# Altium project Flight_Controller.PrjPcb
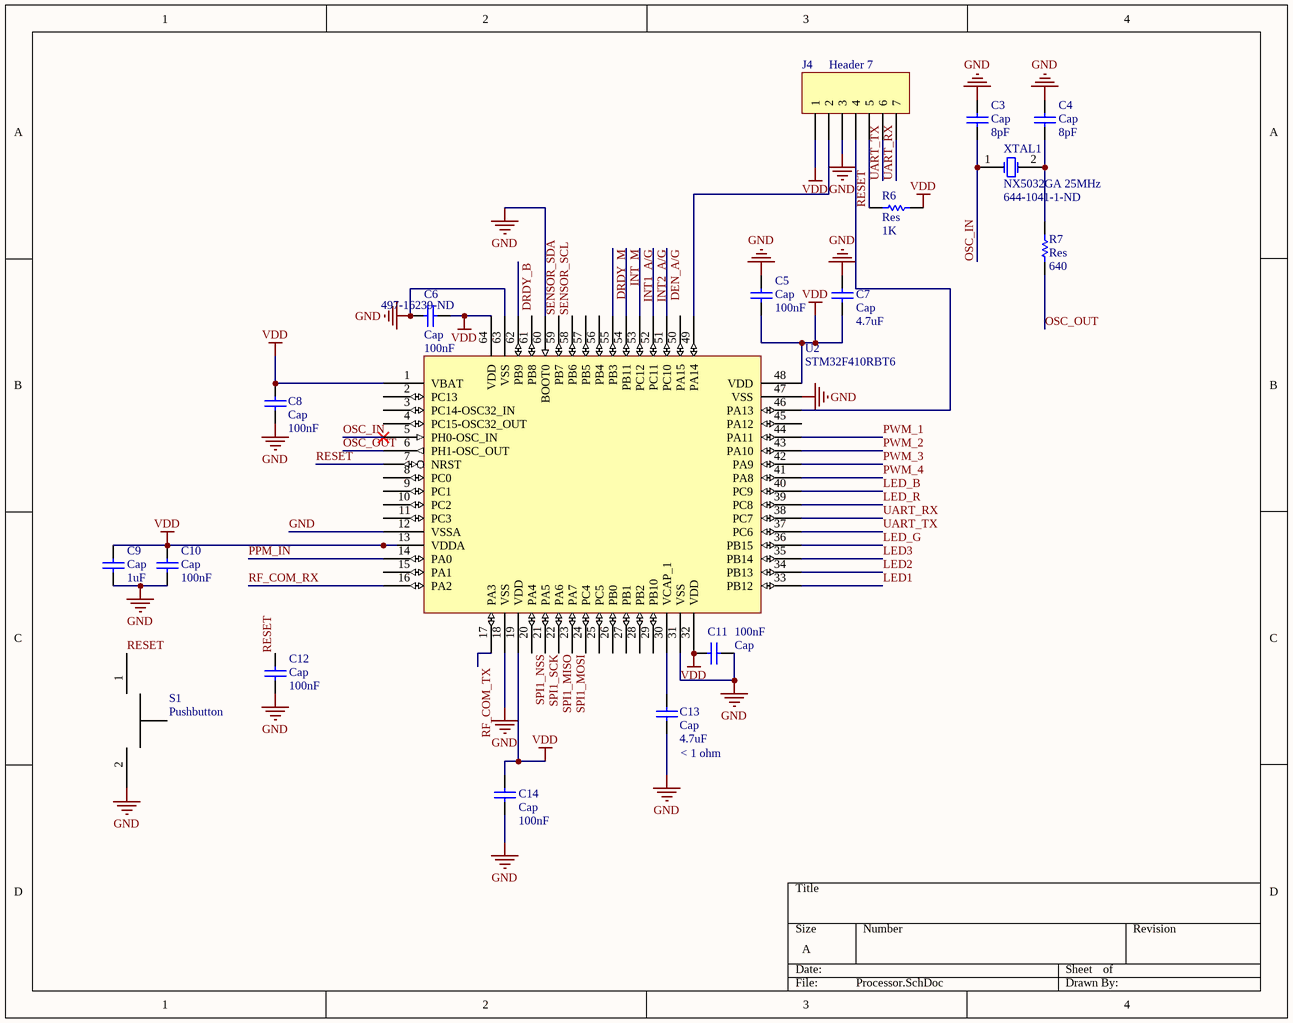
[diagram p0: Processor.SchDoc]
5 sheets, 52 parts. Net scope: global (net labels, ports and power ports of the same name join across sheets).
Board file: Flight_Controller.PcbDoc
Sheets:
  Processor.SchDoc
  Debug.SchDoc
  SENSORS.SchDoc
  Power_Regulation.SchDoc
  RC_Connections.SchDoc

## Sheet Processor.SchDoc
size A

### Parts
C3  Cap  value 8pF  [C0805]
C4  Cap  value 8pF  [C0805]
C5  Cap  value 100nF  [C0805]
C6  Cap  value 100nF  [C0805]
C7  Cap  value 4.7uF  [C0805]
C8  Cap  value 100nF  [C0805]
C9  Cap  value 1uF  [C0805]
C10  Cap  value 100nF  [C0805]
C11  Cap  value 100nF  [C0805]
C12  Cap  value 100nF  [C0805]
C13  Cap  value 4.7uF  ESR: < 1 ohm  [C0805]
C14  Cap  value 100nF  [C0805]
J4  Header 7  [HDR1X7]
R6  Res  value 1K  [3216[1206]]
R7  Res  value 640  [3216[1206]]
S1  Pushbutton  [TactileSwitch]
U2  STM32F410RBT6  Supplier Part Number 1: 497-16239-ND  [LQFP-64 10x10mm]
XTAL1  NX5032GA 25MHz  Supplier Part Number 1: 644-1041-1-ND  [NX5032GA]

### Nets
GND: C3.1 C4.1 C5.2 C6.1 C7.2 C8.2 C9.2 C10.2 C11.2 C12.2 C13.1 C14.1 J4.3 S1.2 U2.12(VSSA) U2.18(VSS) U2.31(VSS) U2.47(VSS) U2.60(BOOT0) U2.63(VSS)
VDD: C5.1 C6.2 C7.1 C8.1 C9.1 C10.1 C11.1 C14.2 J4.1 R6.2 U2.1(VBAT) U2.13(VDDA) U2.19(VDD) U2.32(VDD) U2.48(VDD) U2.64(VDD)
DEN_A/G: U2.51(PC10)
DRDY_B: U2.62(PB9)
DRDY_M: U2.55(PB3)
INT1_A/G: U2.53(PC12)
INT2_A/G: U2.52(PC11)
INT_M: U2.54(PB11)
LED1: U2.33(PB12)
LED2: U2.34(PB13)
LED3: U2.35(PB14)
LED_B: U2.40(PC9)
LED_G: U2.36(PB15)
LED_R: U2.39(PC8)
OSC_IN: C3.2 U2.5(PH0-OSC_IN) XTAL1.1(OSC1)
OSC_OUT: R7.1 U2.6(PH1-OSC_OUT)
PPM_IN: U2.14(PA0)
PWM_1: U2.44(PA11)
PWM_2: U2.43(PA10)
PWM_3: U2.42(PA9)
PWM_4: U2.41(PA8)
RESET: C12.1 J4.5 R6.1 S1.1 U2.7(NRST)
RF_COM_RX: U2.16(PA2)
RF_COM_TX: U2.17(PA3)
SENSOR_SCL: U2.58(PB6)
SENSOR_SDA: U2.59(PB7)
SPI1_MISO: U2.22(PA6)
SPI1_MOSI: U2.23(PA7)
SPI1_NSS: U2.20(PA4)
SPI1_SCK: U2.21(PA5)
UART_RX: J4.7 U2.38(PC7)
UART_TX: J4.6 U2.37(PC6)
NetC4_2: C4.2 R7.2 XTAL1.2(OSC2)
NetC13_2: C13.2 U2.30(VCAP_1)
NetJ4_2: J4.2 U2.49(PA14)
NetJ4_4: J4.4 U2.46(PA13)

Not connected (* = marked no-connect by the designer): U2 2(PC13) 3(PC14-OSC32_IN) 4(PC15-OSC32_OUT) 8(PC0) 9(PC1) 10(PC2) 11(PC3) 15(PA1) 24(PC4) 25(PC5) 26(PB0) 27(PB1) 28(PB2) 29(PB10) 45(PA12) 50(PA15) 56(PB4) 57(PB5) 61(PB8)

### Library data of the parts
C3-C14 = Cap: Capacitor; Published: 8-Jun-2000; LatestRevisionDate: 17-Jul-2002; LatestRevisionNote: Re-released for DXP Platform.; PackageReference: C1206; Publisher: Altium Limited
J4 = Header 7: Header, 7-Pin; LatestRevisionDate: 17-Jul-2002; LatestRevisionNote: Re-released for DXP Platform.; Publisher: Altium Limited
R6 R7 = Res: Surface Mount Resistor; Published: 8-Jun-2000; LatestRevisionDate: 17-Jul-2002; LatestRevisionNote: Re-released for DXP Platform.; PackageReference: AXIAL-0.5; Publisher: Altium Limited
U2 = STM32F410RB_PINOUT: 64-LQFP - Pinout Representation; Manufacturer: STMicroelectronics; Frequency: 100; Interface: I2C,SPI,IrDA,UART,USART,LIN; Number of I/Os: 50; Oscillator Type: Internal; RAM Size: 32; Min Supply Voltage: 1.7; Max Supply Voltage: 3.6; Memory Type: FLASH; Memory Size: 128; Peripherals: Brown-out Detect/Reset,POR,PWM,WDT,DMA; Supplier 1: Digikey; Manufacturer Part Number: STM32F410RBT6; Pricing 2: 1=4.4, 10=3.951, 100=3.237, 500=2.7556, 1000=2.324 (USD); Case/Package: LQFP; Number of Pins: 64; Min Operating Temperature: -40; Max Operating Temperature: 85; Packaging: Tray; REACH SVHC: No SVHC; Lead Free: Lead Free; ComponentLink1URL: http://www.farnell.com/datasheets/2006536.pdf; ComponentLink1Description: http://www.farnell.com/datasheets/2006536.pdf
XTAL1 = NX5032GA: Manufacturer: Nihon Dempa Kogyo (NDK); Manufacturer Part Number: NX5032GA-25.000000MHZ-LN-CD-1; Frequency: 25; Frequency Tolerance: 50; Load Capacitance: 8; ESR (Equivalent Series Resistance): 70; Supplier 1: Digikey; Stock 1: 128038; Pricing 1: 1=0.66, 10=0.55, 50=0.495, 100=0.44, 500=0.418 (USD); Case/Package: SMD/SMT; Number of Pins: 2; Min Operating Temperature: -10; Max Operating Temperature: 70; Packaging: Tape and Reel; Frequency Stability: 50; Package Quantity: 1000; Length: 0.197; Height: 0.059; Width: 0.126; ComponentLink1URL: https://datasheet.ciiva.com/856/nx5032ga-856797.pdf; ComponentLink1Description: https://datasheet.ciiva.com/856/nx5032ga-856797.pdf; ComponentLink2URL: https://datasheet.ciiva.com/856/nx5032ga-856798.pdf; ComponentLink2Description: https://datasheet.ciiva.com/856/nx5032ga-856798.pdf; ComponentLink3URL: https://datasheet.ciiva.com/856/nx5032ga-856799.pdf; ComponentLink3Description: https://datasheet.ciiva.com/856/nx5032ga-856799.pdf

## Sheet Debug.SchDoc
size A
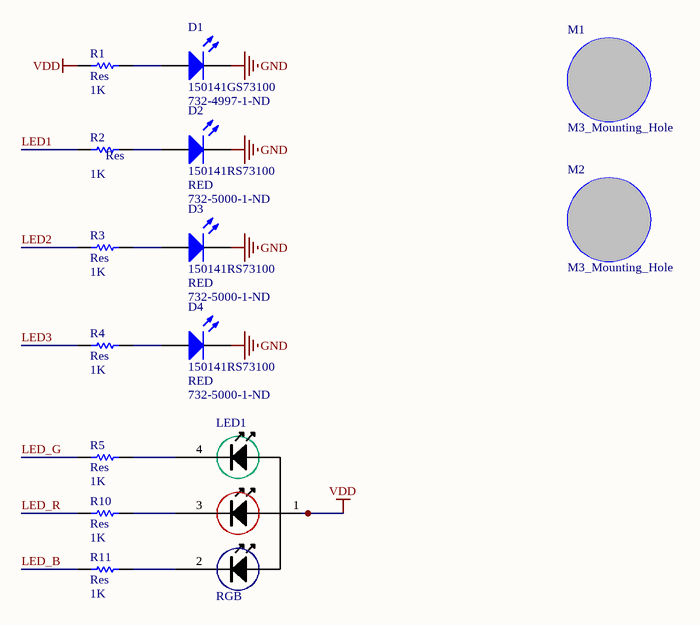
[diagram p1: Debug.SchDoc]

### Parts
D1  150141GS73100  Supplier Part Number 1: 732-4997-1-ND  [150141RS73100]
D2  150141RS73100  Colour: RED  Supplier Part Number 2: 732-5000-1-ND  [150141RS73100]
D3  150141RS73100  Colour: RED  Supplier Part Number 2: 732-5000-1-ND  [150141RS73100]
D4  150141RS73100  Colour: RED  Supplier Part Number 2: 732-5000-1-ND  [150141RS73100]
LED1  RGB  [1411LED]
M1  M3_Mounting_Hole  [M3_Mounting_Hole]
M2  M3_Mounting_Hole  [M3_Mounting_Hole]
R1  Res  value 1K  [3216[1206]]
R2  Res  value 1K  [3216[1206]]
R3  Res  value 1K  [3216[1206]]
R4  Res  value 1K  [3216[1206]]
R5  Res  value 1K  [3216[1206]]
R10  Res  value 1K  [3216[1206]]
R11  Res  value 1K  [3216[1206]]

### Nets
GND: D1.2(K) D2.2(K) D3.2(K) D4.2(K)
VDD: LED1.1 R1.1
LED1: R2.1
LED2: R3.1
LED3: R4.1
LED_B: R11.1
LED_G: R5.1
LED_R: R10.1
NetD1_1: D1.1(A) R1.2
NetD2_1: D2.1(A) R2.2
NetD3_1: D3.1(A) R3.2
NetD4_1: D4.1(A) R4.2
NetLED1_2: LED1.2 R11.2
NetLED1_3: LED1.3 R10.2
NetLED1_4: LED1.4 R5.2

### Library data of the parts
D1 = 150141GS73100: Typical GREEN LED; Manufacturer: Würth Elektronik (Wuerth Elektronik); Luminous Intensity: 1000; Viewing Angle: 120; Forward Voltage: 3.1; Lens Style: Round,Clear; Wavelength: 525; Forward Current: 30; Test Current: 20; Supplier 1: Digikey; Manufacturer Part Number: 150141GS73100; Stock 1: 572; Pricing 1: 1=0.17, 100=0.149, 500=0.113 (USD); Case/Package: 1411; Colour: Green; Case Code (Metric): 3528; Case Code (Imperial): 1411; Min Operating Temperature: -40; Max Operating Temperature: 85; Packaging: Cut Tape; Package Quantity: 2000; Dominant Wavelength: 525; Length: 3.5; Height: 1.9; Width: 2.8; REACH SVHC: Unknown; Lead Free: Lead Free; ComponentLink1URL: https://datasheet.ciiva.com/23843/150141gs73100-23843266.pdf; ComponentLink1Description: https://datasheet.ciiva.com/23843/150141gs73100-23843266.pdf; ComponentLink2URL: https://datasheet.ciiva.com/22656/1911484-22656997.pdf; ComponentLink2Description: https://datasheet.ciiva.com/22656/1911484-22656997.pdf; ComponentLink3URL: https://datasheet.ciiva.com/29563/150141gs73100-29563029.pdf; ComponentLink3Description: https://datasheet.ciiva.com/29563/150141gs73100-29563029.pdf; ComponentLink4URL: https://datasheet.ciiva.com/29563/150141gs73100-29563030.pdf; ComponentLink4Description: https://datasheet.ciiva.com/29563/150141gs73100-29563030.pdf; ComponentLink5URL: https://datasheet.ciiva.com/48430/150141gs73100-eng-tds-48430060.pdf; ComponentLink5Description: https://datasheet.ciiva.com/48430/150141gs73100-eng-tds-48430060.pdf; ComponentLink6URL: https://datasheet.ciiva.com/29278/759463-da-01-en-smd-topled-einf-gruen-150141gs73100-29278953.pdf; ComponentLink6Description: https://datasheet.ciiva.com/29278/759463-da-01-en-smd-topled-einf-gruen-150141gs73100-29278953.pdf
D2-D4 = 150141RS73100: Typical RED LED; Manufacturer: Würth Elektronik (Wuerth Elektronik); Luminous Intensity: 300; Viewing Angle: 120; Forward Voltage: 2; Lens Style: Round,Clear; Wavelength: 625; Forward Current: 30; Test Current: 20; Published: 8-Jun-2000; LatestRevisionDate: 17-Jul-2002; LatestRevisionNote: Re-released for DXP Platform.; PackageDocument: Feb-2002; PackageReference: 3.2X1.6X1.1; Publisher: Altium Limited; Supplier 1: Digi-Key; Supplier 2: Digikey; Manufacturer Part Number: 150141RS73100; Stock 2: 5335; Pricing 2: 1=0.17, 100=0.149, 500=0.113 (USD); Case/Package: 1411; Case Code (Metric): 3528; Case Code (Imperial): 1411; Min Operating Temperature: -40; Max Operating Temperature: 85; Package Quantity: 2000; Packaging: Tape and Reel; Dominant Wavelength: 625; Length: 3.5; Height: 1.9; Width: 2.8; REACH SVHC: Unknown; ComponentLink1URL: https://datasheet.ciiva.com/29562/150141rs73100-29562993.pdf; ComponentLink1Description: https://datasheet.ciiva.com/29562/150141rs73100-29562993.pdf; ComponentLink2URL: https://datasheet.ciiva.com/29563/150141rs73100-29563031.pdf; ComponentLink2Description: https://datasheet.ciiva.com/29563/150141rs73100-29563031.pdf; ComponentLink3URL: https://datasheet.ciiva.com/29563/150141rs73100-29563032.pdf; ComponentLink3Description: https://datasheet.ciiva.com/29563/150141rs73100-29563032.pdf; ComponentLink4URL: https://datasheet.ciiva.com/29278/759464-da-01-en-smd-topled-einf-rot-150141rs73100-29278947.pdf; ComponentLink4Description: https://datasheet.ciiva.com/29278/759464-da-01-en-smd-topled-einf-rot-150141rs73100-29278947.pdf
LED1 = LED_150141M173100: Wurth RGB LED 1411 pkg; Manufacturer: Wurth Electronics Inc; Color: Red, Green, Blue (RGB); Lens Color: Colorless; Lens Transparency: Clear; Millicandela Rating: 270mcd Red, 950mcd Green, 230mcd Blue; Lens Style/Size: Round with Flat Top, 2.40mm; Voltage - Forward (Vf) (Typ): 2V Red, 3.2V Green, 3.2V Blue; Current - Test: 20mA Red, 20mA Green, 20mA Blue; Viewing Angle: 120°; Wavelength - Dominant: 625nm Red, 520nm Green, 470nm Blue; Wavelength - Peak: 635nm Red, 515nm Green, 465nm Blue; Supplier 1: Digi-Key; Supplier Part Number 1: 732-4998-1-ND; RoHS: RoHS Compliant; Category: Optoelectronics; Stock 1: 986; Pricing 1: 1=0.95, 50=0.8294, 100=0.7583, 500=0.68724, 1000=0.63984 (CAD); Packaging: Cut Tape (CT); Mounting Type: Surface Mount; Features: -; Package / Case: 1411 (3528 Metric); Supplier Device Package: 3528; Size / Dimension: 3.50mm L x 2.80mm W; Height (Max): 2.10mm; ComponentLink1URL: http://katalog.we-online.de/led/datasheet/150141M173100.pdf; ComponentLink1Description: http://katalog.we-online.de/led/datasheet/150141M173100.pdf; Manufacturer Part Number: 150141M173100
R1-R5 R10 R11 = Res: Surface Mount Resistor; Published: 8-Jun-2000; LatestRevisionDate: 17-Jul-2002; LatestRevisionNote: Re-released for DXP Platform.; PackageReference: AXIAL-0.5; Publisher: Altium Limited

## Sheet SENSORS.SchDoc
size A
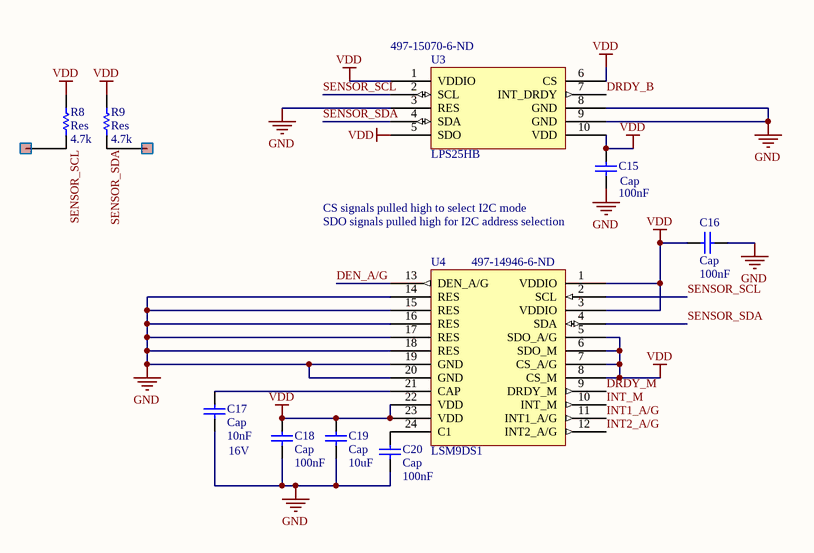
[diagram p2: SENSORS.SchDoc]

### Parts
C15  Cap  value 100nF  [C0805]
C16  Cap  value 100nF  [C0805]
C17  Cap  value 10nF  Rating: 16V  [C0805]
C18  Cap  value 100nF  [C0805]
C19  Cap  value 10uF  [C0805]
C20  Cap  value 100nF  [C0805]
R8  Res  value 4.7k  [3216[1206]]
R9  Res  value 4.7k  [3216[1206]]
TPS1  Test_point_SMD  [TEST_POINT_SMD]  (value not drawn)
TPS2  Test_point_SMD  [TEST_POINT_SMD]  (value not drawn)
U3  LPS25HB  Supplier Part Number 1: 497-15070-6-ND  [HLGA-10L - narrow]
U4  LSM9DS1  Supplier Part Number 1: 497-14946-6-ND  [LGA-24 - NARROW - Long Pads]

### Nets
GND: C15.1 C16.2 C17.2 C18.2 C19.2 C20.1 U3.3(RES) U3.8(GND) U3.9(GND) U4.14(RES) U4.15(RES) U4.16(RES) U4.17(RES) U4.18(RES) U4.19(GND) U4.20(GND)
VDD: C15.2 C16.1 C18.1 C19.1 R8.1 R9.1 U3.1(VDDIO) U3.5(SDO) U3.6(CS) U3.10(VDD) U4.1(VDDIO) U4.3(VDDIO) U4.5(SDO_A/G) U4.6(SDO_M) U4.7(CS_A/G) U4.8(CS_M) U4.22(VDD) U4.23(VDD)
DEN_A/G: U4.13(DEN_A/G)
DRDY_B: U3.7(INT_DRDY)
DRDY_M: U4.9(DRDY_M)
INT1_A/G: U4.11(INT1_A/G)
INT2_A/G: U4.12(INT2_A/G)
INT_M: U4.10(INT_M)
SENSOR_SCL: R8.2 TPS1.1 U3.2(SCL) U4.2(SCL)
SENSOR_SDA: R9.2 TPS2.1 U3.4(SDA) U4.4(SDA)
NetC17_1: C17.1 U4.21(CAP)
NetC20_2: C20.2 U4.24(C1)

### Notes on the sheet
- CS signals pulled high to select I2C mode
- SDO signals pulled high for I2C address selection

### Library data of the parts
C15-C20 = Cap: Capacitor; Published: 8-Jun-2000; LatestRevisionDate: 17-Jul-2002; LatestRevisionNote: Re-released for DXP Platform.; PackageReference: C1206; Publisher: Altium Limited
R8 R9 = Res: Surface Mount Resistor; Published: 8-Jun-2000; LatestRevisionDate: 17-Jul-2002; LatestRevisionNote: Re-released for DXP Platform.; PackageReference: AXIAL-0.5; Publisher: Altium Limited
TPS1 TPS2 = Test_point_SMD: Test Point SMD
U3 = LPS25HB: Manufacturer: STMicroelectronics; Manufacturer Part Number: LPS25HBTR; Operating Pressure: 18.27; Port Style: No Port; Max Pressure: 290.08; Min Supply Voltage: 1.7; Max Supply Voltage: 3.6; Supplier 1: Digikey; Stock 1: 0; Pricing 1: 1=3.25, 10=2.917, 100=2.3901 (USD); Mount: Surface Mount; Number of Pins: 10; Contact Plating: Nickel,Gold; Min Operating Temperature: -30; Max Operating Temperature: 105; Termination: Solder; REACH SVHC: No SVHC; Lead Free: Lead Free; ComponentLink1URL: http://www.farnell.com/datasheets/1992925.pdf; ComponentLink1Description: http://www.farnell.com/datasheets/1992925.pdf; ComponentLink2URL: http://www.st.com/st-web-ui/static/active/en/resource/technical/document/datasheet/DM00141379.pdf; ComponentLink2Description: http://www.st.com/st-web-ui/static/active/en/resource/technical/document/datasheet/DM00141379.pdf
U4 = LSM9DS1: Manufacturer: STMicroelectronics; Manufacturer Part Number: LSM9DS1TR; Min Supply Voltage: 1.9; Max Supply Voltage: 3.6; Supplier 1: Digikey; Stock 1: 6141; Pricing 1: 1=6.4, 10=5.751, 100=4.7119 (USD); Case/Package: LGA; Number of Pins: 24; Min Operating Temperature: -40; Max Operating Temperature: 85; Packaging: Cut Tape; REACH SVHC: No SVHC; Lead Free: Lead Free; ComponentLink1URL: http://www.farnell.com/datasheets/2028150.pdf; ComponentLink1Description: http://www.farnell.com/datasheets/2028150.pdf

## Sheet Power_Regulation.SchDoc
size A
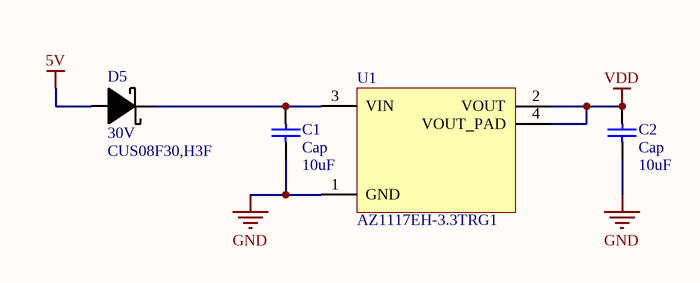
[diagram p3: Power_Regulation.SchDoc]

### Parts
C1  Cap  value 10uF  [C0805]
C2  Cap  value 10uF  [C0805]
D5  Voltage - DC Reverse (Vr) (Max): 30V  Manufacturer Part Number: CUS08F30,H3F  [SOD323]  (hidden comment: Schottky Diode)
U1  Manufacturer Part Number: AZ1117EH-3.3TRG1  [SOT223]  (hidden comment: U_AZ1117EH-3.3TRG1)

### Nets
5V: D5.2(AN)
GND: C1.1 C2.1 U1.1(GND)
VDD: C2.2 U1.2(VOUT) U1.4(VOUT_PAD)
NetC1_2: C1.2 D5.1(CA) U1.3(VIN)

### Library data of the parts
C1 C2 = Cap: Capacitor; Published: 8-Jun-2000; LatestRevisionDate: 17-Jul-2002; LatestRevisionNote: Re-released for DXP Platform.; PackageReference: C1206; Publisher: Altium Limited
D5 = DS_CUS08F30: Diode Schottky 30V 800mA (DC) Surface Mount SOD-323; Manufacturer: Toshiba Semiconductor and Storage; Voltage - Forward (Vf) (Max) @ If: 220mV @ 10mA; Speed: Fast Recovery =< 500ns, > 200mA (Io); Current - Reverse Leakage @ Vr: 50µA @ 30V; Capacitance @ Vr, F: 170pF @ 0V, 1MHz; Packaging: Cut Tape (CT); Part Status: Active; Diode Type: Schottky; Current - Average Rectified (Io): 800mA; Reverse Recovery Time (trr): -; Mounting Type: Surface Mount; Package / Case: SC-76, SOD-323; Supplier Device Package: USC; Operating Temperature - Junction: 125°C (Max); ComponentLink1URL: https://toshiba.semicon-storage.com/info/docget.jsp?did=9019&prodName=CUS08F30; ComponentLink1Description: https://toshiba.semicon-storage.com/info/docget.jsp?did=9019&prodName=CUS08F30; Supplier 1: Digi-Key; Supplier Part Number 1: CUS08F30H3FCT-ND; RoHS: RoHS Compliant; Category: Discrete Semiconductor Products; Stock 1: 5288; Pricing 1: 1=0.49, 10=0.448, 25=0.3224, 100=0.2508, 250=0.15764, 500=0.13438, 1000=0.09138 (CAD)
U1 = U_AZ1117EH-3.3TRG1: IC LDO 3.3V 1A; Manufacturer: Diodes Incorporated; Regulator Topology: Positive Fixed; Voltage - Dropout (Typical): 1.1V @ 1A; Number of Regulators: 1; Voltage - Input: Up to 13V; Supplier 1: Digi-Key; Supplier Part Number 1: AZ1117EH-3.3TRG1DICT-ND; RoHS: RoHS Compliant; Category: Integrated Circuits (ICs); Stock 1: 13427; Pricing: 1=0.61, 10=0.456, 100=0.2578, 500=0.1709, 1000=0.13108 (CAD); Packaging: Cut Tape (CT); Voltage - Output: 3.3V; Current - Output: 1A; Current - Limit (Min): -; Operating Temperature: -40°C ~ 125°C; Mounting Type: Surface Mount; Package / Case: TO-261-4, TO-261AA; Supplier Device Package: SOT-223; ComponentLink1URL: http://www.diodes.com/_files/datasheets/AZ1117E.pdf; ComponentLink1Description: http://www.diodes.com/_files/datasheets/AZ1117E.pdf

## Sheet RC_Connections.SchDoc
size A
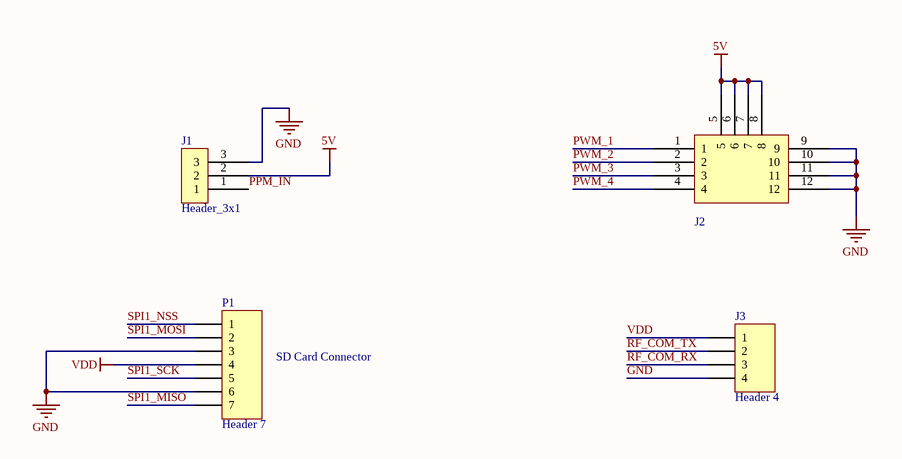
[diagram p4: RC_Connections.SchDoc]

### Parts
J1  Header_3x1  [Header_3x1]
J2  Header 4x3  [Header_4x3]  (value not drawn)
J3  Header 4  [HDR1X4]
P1  Header 7  [HDR1X7]

### Nets
5V: J1.2 J2.5 J2.6 J2.7 J2.8
GND: J1.3 J2.9 J2.10 J2.11 J2.12 J3.4 P1.3 P1.6
VDD: J3.1 P1.4
PPM_IN: J1.1
PWM_1: J2.1
PWM_2: J2.2
PWM_3: J2.3
PWM_4: J2.4
RF_COM_RX: J3.3
RF_COM_TX: J3.2
SPI1_MISO: P1.7
SPI1_MOSI: P1.2
SPI1_NSS: P1.1
SPI1_SCK: P1.5

### Notes on the sheet
- SD Card Connector

### Library data of the parts
J2 = Header_4x3
J3 = Header 4: Header, 4-Pin; LatestRevisionDate: 17-Jul-2002; LatestRevisionNote: Re-released for DXP Platform.; Publisher: Altium Limited
P1 = Header 7: Header, 7-Pin; LatestRevisionDate: 17-Jul-2002; LatestRevisionNote: Re-released for DXP Platform.; Publisher: Altium Limited

## Nets that join several sheets
5V: Power_Regulation (D5.2), RC_Connections (5 pins)
GND: Processor (20 pins), Debug (D1.2 D2.2 D3.2 D4.2), SENSORS (16 pins), Power_Regulation (C1.1 C2.1 U1.1), RC_Connections (8 pins)
VDD: Processor (16 pins), Debug (LED1.1 R1.1), SENSORS (18 pins), Power_Regulation (C2.2 U1.2 U1.4), RC_Connections (J3.1 P1.4)
DEN_A/G: Processor (U2.51), SENSORS (U4.13)
DRDY_B: Processor (U2.62), SENSORS (U3.7)
DRDY_M: Processor (U2.55), SENSORS (U4.9)
INT1_A/G: Processor (U2.53), SENSORS (U4.11)
INT2_A/G: Processor (U2.52), SENSORS (U4.12)
INT_M: Processor (U2.54), SENSORS (U4.10)
LED1: Processor (U2.33), Debug (R2.1)
LED2: Processor (U2.34), Debug (R3.1)
LED3: Processor (U2.35), Debug (R4.1)
LED_B: Processor (U2.40), Debug (R11.1)
LED_G: Processor (U2.36), Debug (R5.1)
LED_R: Processor (U2.39), Debug (R10.1)
PPM_IN: Processor (U2.14), RC_Connections (J1.1)
PWM_1: Processor (U2.44), RC_Connections (J2.1)
PWM_2: Processor (U2.43), RC_Connections (J2.2)
PWM_3: Processor (U2.42), RC_Connections (J2.3)
PWM_4: Processor (U2.41), RC_Connections (J2.4)
RF_COM_RX: Processor (U2.16), RC_Connections (J3.3)
RF_COM_TX: Processor (U2.17), RC_Connections (J3.2)
SENSOR_SCL: Processor (U2.58), SENSORS (R8.2 TPS1.1 U3.2 U4.2)
SENSOR_SDA: Processor (U2.59), SENSORS (R9.2 TPS2.1 U3.4 U4.4)
SPI1_MISO: Processor (U2.22), RC_Connections (P1.7)
SPI1_MOSI: Processor (U2.23), RC_Connections (P1.2)
SPI1_NSS: Processor (U2.20), RC_Connections (P1.1)
SPI1_SCK: Processor (U2.21), RC_Connections (P1.5)